# EAGLE design sbus-ppm (EAGLE 6.2)
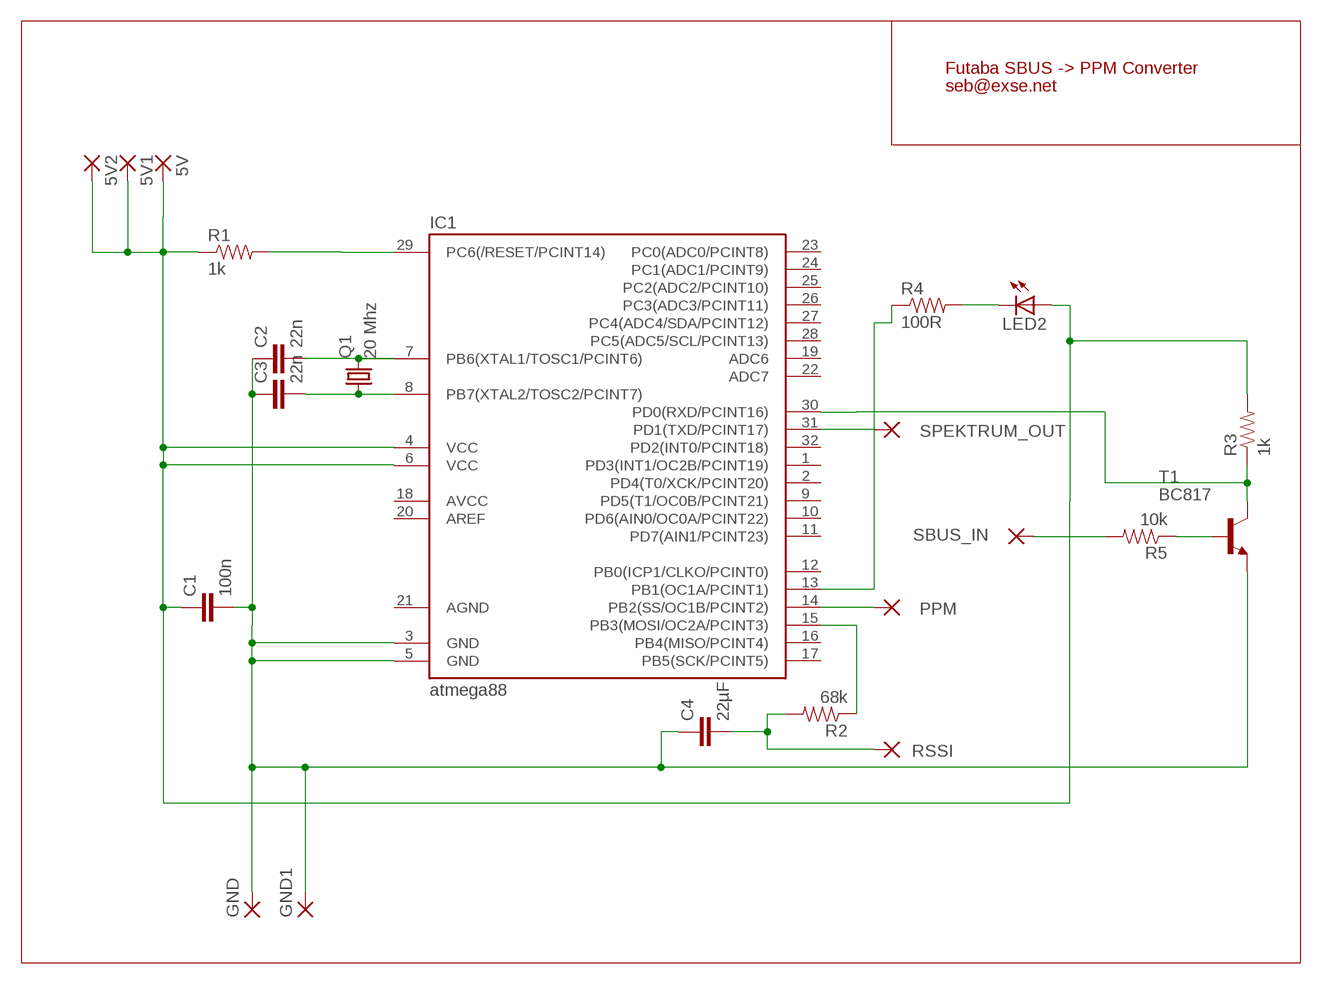
[diagram p0: schematic, sheet 1]

## Parts
5V  SMD2  [SMD1,27-2,54]
5V1  SMD2  [SMD1,27-2,54]
5V2  SMD2  [SMD1,27-2,54]
C1  100n  CAP0805  [0805]
C2  22n  CAP0805  [0805]
C3  22n  CAP0805  [0805]
C4  22µF  CAP0805  [0805]
GND  SMD2  [SMD1,27-2,54]
GND1  SMD2  [SMD1,27-2,54]
IC1  atmega88  MEGA48/88/168-AU  [TQFP32-08]
LED2  LEDCHIPLED_0805  [CHIPLED_0805]
PPM  SMD2  [SMD1,27-2,54]
Q1  20 Mhz  X22-OSCILLATOR  [X22]
R1  1k  RESISTOR  [0805]
R2  68k  RESISTOR  [0805]
R3  1k  RESISTOR  [0805]
R4  100R  RESISTOR  [0805]
R5  10k  RESISTOR  [0805]
RSSI  SMD2  [SMD1,27-2,54]
SBUS_IN  SMD2  [SMD1,27-2,54]
SPEKTRUM_OUT  SMD2  [SMD1,27-2,54]
T1  BC817  BC847  [SOT23]

## Nets
+5V: 5V1.1(P) 5V2.1(P) 5V.1(P) C1.1 IC1.4(VCC) IC1.6(VCC) LED2.A R1.1 R3.2
GND: C1.2 C2.1 C3.1 C4.1 GND1.1(P) GND.1(P) IC1.3(GND) IC1.5(GND) T1.2(E)
N$3: IC1.15(PB3(MOSI/OC2A/PCINT3)) R2.1
N$4: IC1.14(PB2(SS/OC1B/PCINT2)) PPM.1(P)
N$5: R5.2 SBUS_IN.1(P)
N$7: C4.2 R2.2 RSSI.1(P)
N$8: IC1.29(PC6(/RESET/PCINT14)) R1.2
N$9: C3.2 IC1.8(PB7(XTAL2/TOSC2/PCINT7)) Q1.1
N$10: C2.2 IC1.7(PB6(XTAL1/TOSC1/PCINT6)) Q1.3
N$11: R5.1 T1.1(B)
N$12: IC1.31(PD1(TXD/PCINT17)) SPEKTRUM_OUT.1(P)
N$14: LED2.C R4.2
N$15: IC1.13(PB1(OC1A/PCINT1)) R4.1
N$16: IC1.30(PD0(RXD/PCINT16)) R3.1 T1.3(C)
Unconnected: IC1.1(PD3(INT1/OC2B/PCINT19)) IC1.2(PD4(T0/XCK/PCINT20)) IC1.9(PD5(T1/OC0B/PCINT21)) IC1.10(PD6(AIN0/OC0A/PCINT22)) IC1.11(PD7(AIN1/PCINT23)) IC1.12(PB0(ICP1/CLKO/PCINT0)) IC1.16(PB4(MISO/PCINT4)) IC1.17(PB5(SCK/PCINT5)) IC1.18(AVCC) IC1.19(ADC6) IC1.20(AREF) IC1.22(ADC7) IC1.23(PC0(ADC0/PCINT8)) IC1.24(PC1(ADC1/PCINT9)) IC1.25(PC2(ADC2/PCINT10)) IC1.26(PC3(ADC3/PCINT11)) IC1.27(PC4(ADC4/SDA/PCINT12)) IC1.28(PC5(ADC5/SCL/PCINT13)) IC1.32(PD2(INT0/PCINT18))

## Notes on the sheet
- Futaba SBUS -> PPM Converter
- seb@exse.net

## Power pins joined to a net without a drawn wire
AGND: IC1.21(AGND)

## Library data of the parts
5V 5V1 5V2 GND GND1 PPM RSSI SBUS_IN SPEKTRUM_OUT = wirepad:SMD2: SMD PAD
C1-C4 = SparkFun:CAP: Capacitor Standard 0603 ceramic capacitor, and 0.1" leaded capacitor.
IC1 = avr-4:MEGA48/88/168
LED2 = led:LED: LED OSRAM: - CHIPLED LG R971, LG N971, LY N971, LG Q971, LY Q971, LO R971, LY R971 LH N974, LH R974 LS Q976, LO Q976, LY Q976 LO Q996 - Hyper CHIPLED LW Q18S LB Q993, LB Q99A, LB R99A - SideLED LS A670, LO A670, LY A670, LG A670, LP A670 LB A673, LV A673, LT A673, LW A673 LH A674 LY A675 LS A676, LA A676, LO A676, LY A676, LW A676 LS A679, LY A679, LG A679 - Hyper Micro SIDELED® LS Y876, LA Y876, LO Y876, LY Y876 LT Y87S - SmartLED LW L88C, LW L88S LB L89C, LB L89S, LG L890 LS L89K, LO L89K, LY L89K LS L896, LA L896, LO L896, LY L896 - TOPLED LS T670, LO T670, LY T670, LG T670, LP T670 LSG T670, LSP T670, LSY T670, LOP T670, LYG T670 LG T671, LOG T671, LSG T671 LB T673, LV T673, LT T673, LW T673 LH T674 LS T676, LA T676, LO T676, LY T676, LB T676, LH T676, LSB T676, LW T676 LB T67C, LV T67C, LT T67C, LS T67K, LO T67K, LY T67K, LW E67C LS E67B, LA E67B, LO E67B, LY E67B, LB E67C, LV E67C, LT E67C LW T67C LS T679, LY T679, LG T679 LS T770, LO T770, LY T770, LG T770, LP T770 LB T773, LV T773, LT T773, LW T773 LH T774 LS E675, LA E675, LY E675, LS T675 LS T776, LA T776, LO T776, LY T776, LB T776 LHGB T686 LT T68C, LB T68C - Hyper Mini TOPLED® LB M676 - Mini TOPLED Santana® LG M470 LS M47K, LO M47K, LY M47K Source: http://www.osram.convergy.de LUXEON: - LUMILED® LXK2-PW12-R00, LXK2-PW12-S00, LXK2-PW14-U00, LXK2-PW14-V00 LXK2-PM12-R00, LXK2-PM12-S00, LXK2-PM14-U00 LXK2-PE12-Q00, LXK2-PE12-R00, LXK2-PE12-S00, LXK2-PE14-T00, LXK2-PE14-U00 LXK2-PB12-K00, LXK2-PB12-L00, LXK2-PB12-M00, LXK2-PB14-N00, LXK2-PB14-P00, LXK2-PB14-Q00 LXK2-PR12-L00, LXK2-PR12-M00, LXK2-PR14-Q00, LXK2-PR14-R00 LXK2-PD12-Q00, LXK2-PD12-R00, LXK2-PD12-S00 LXK2-PH12-R00, LXK2-PH12-S00 LXK2-PL12-P00, LXK2-PL12-Q00, LXK2-PL12-R00 Source: www.luxeon.com KINGBRIGHT: KA-3528ASYC Source: www.kingbright.com
Q1 = seb:X22-OSCILLATOR
R1-R5 = SparkFun:RESISTOR: Resistor Basic schematic elements and footprints for 0603, 1206, and PTH 1/10th watt (small) resistors.
T1 = transistor:BC847: NPN TRANSISTOR

## Board
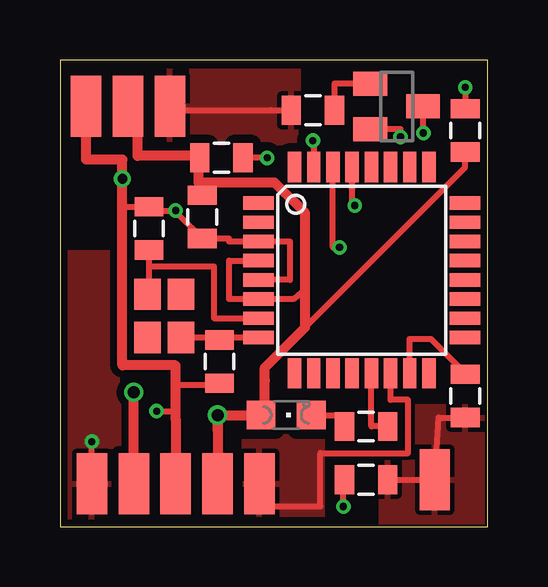
[diagram p1: board, top side]
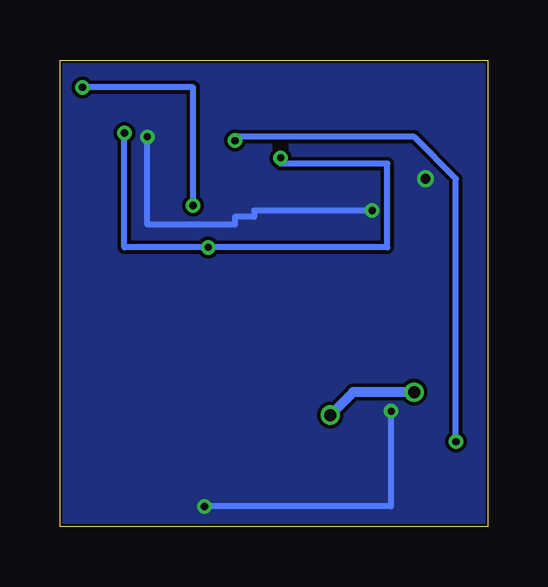
[diagram p2: board, bottom side, seen from below]

Size 17.82 x 19.45 mm. Coordinates in mm from the lower left corner, seen from the top.
Outline: 0,0 17.82,0 17.82,19.45 0,19.45 0,0
Copper layers (1*16): Top 0.035mm / dielectric 1.5mm / Bottom 0.035mm
Design rules "default": minimum track width 0.15mm, minimum drill 0.3mm, track to track 0.15mm, track to pad 0.15mm, pad to pad 0.15mm, via to via 0.15mm, smd to smd 0.15mm, copper to edge 0.1mm, drill to drill 0.2mm, minimum pad ring 0.2mm, minimum via ring 0.15mm, stop-mask expansion 0.075mm, vias tented up to drill 30mil, thermal gap 0.2mm

### Footprints (pad centres in the part's own frame; a part is rotated, then mirrored left to right if it is on the bottom)
SMD1,27-2,54 = smd 1.27 x 2.54: 1 0,0
0805 = smd 0.8 x 1.2: 1 -0.9,0; 2 0.9,0
TQFP32-08 = smd 1.27 x 0.559: 1 -4.293,2.8; 2 -4.293,2; 3 -4.293,1.2; 4 -4.293,0.4; 5 -4.293,-0.4; 6 -4.293,-1.2; 7 -4.293,-2; 8 -4.293,-2.8; 17 4.293,-2.8; 18 4.293,-2; 19 4.293,-1.2; 20 4.293,-0.4; 21 4.293,0.4; 22 4.293,1.2; 23 4.293,2; 24 4.293,2.8 | smd 0.559 x 1.27: 9 -2.8,-4.293; 10 -2,-4.293; 11 -1.2,-4.293; 12 -0.4,-4.293; 13 0.4,-4.293; 14 1.2,-4.293; 15 2,-4.293; 16 2.8,-4.293; 25 2.8,4.293; 26 2,4.293; 27 1.2,4.293; 28 0.4,4.293; 29 -0.4,4.293; 30 -1.2,4.293; 31 -2,4.293; 32 -2.8,4.293
CHIPLED_0805 = smd 1.2 x 1.2: A 0,-1.05; C 0,1.05
X22 = smd 1.3 x 1.1: 1 0.9,0.7; 2 -0.9,0.7; 3 -0.9,-0.7; 4 0.9,-0.7
SOT23 = smd 1 x 1.4: 1 -0.95,-1.1; 2 0.95,-1.1; 3 0,1.1

### Placement (x,y rotation side)
5V  2.84,17.52 0 top
5V1  6.57,1.8 180 top
5V2  3.07,1.8 0 top
C1  5.93,12.92 270 top
C2  3.71,12.44 270 top
C3  6.64,6.88 90 top
C4  12.76,1.96 0 top
GND  1.09,17.52 180 top
GND1  4.82,1.8 180 top
IC1  12.57,10.69 0 top
LED2  9.42,4.66 270 top
PPM  8.31,1.8 180 top
Q1  4.34,8.79 270 top
R1  16.88,16.52 90 top
R2  16.88,5.45 270 top
R3  6.72,15.38 180 top
R4  12.76,4.18 180 top
R5  10.53,17.36 180 top
RSSI  15.61,1.96 0 top
SBUS_IN  4.58,17.52 180 top
SPEKTRUM_OUT  1.33,1.8 0 top
T1  14.03,17.52 270 top

### Tracks (layer width: path | path; a pad name or v marks a point on that pad's centre or on a via)
+5V  (via drill 0.5)
  Top 0.254: 10.21,8.32 16.88,14.99 R1.1 | 10.21,9.9 9.74,9.49 IC1.6 7.04,9.49 7.04,11.09 IC1.4 | 5.77,15.46 R3.2 | LED2.A 8.85,4.66 8.53,4.66 | C1.1 6.46,14.34 5.77,14.34
  Top 0.406: v6.57,4.66 5V1.1 | 5V2.1 v3.07,5.61 | v6.57,4.66 8.53,4.66 8.53,6.09 8.53,6.64 10.21,8.32 10.21,9.9 10.21,13.08 8.95,14.34 5.77,14.34 5.77,15.46 3.23,15.46 3.23,17.52 5V.1 | v6.57,4.66 6.57,4.03 v6.57,4.66
  Bottom 0.406: v6.57,4.66 5.61,5.61 v3.07,5.61
GND  (via drill 0.3, 0.4)
  Top 0.254: 2.6,13.34 C2.1 3.39,13.18 v4.82,13.18 4.98,12.97 C1.2 7.04,12.02 7.04,11.89 IC1.3 9.58,11.89 9.58,10.29 IC1.5 | 4.82,2.91 GND1.1 | C4.1 11.8,1.96 v11.8,0.85 | v4.03,4.82 4.82,4.82 4.82,4.5 | T1.2 14.19,16.57 v14.19,16.25 | C3.1 6.54,5.93 4.82,5.93
  Top 0.406: 4.82,2.91 4.82,4.5 4.82,5.93 4.82,6.72 2.6,6.72 2.6,13.34 v2.6,14.5 2.6,15.3 1.09,15.3 GND.1
  Bottom 0.254: v11.8,0.85 4.03,0.85 v4.03,4.82 | v14.19,16.25 14.19,12.6 10.53,12.6 10.53,12.92 9.74,12.92 9.74,13.18 v4.82,13.18
  pour Bottom: 0.06,19.27 17.84,19.27 17.84,0.06 0.06,0.06
N$3
  Top 0.254: R2.1 16.88,6.41 15.46,7.84 14.57,7.84 IC1.15
N$4
  Top 0.254: PPM.1 8.15,1.8 8.15,0.85 10.85,0.85 10.85,3.07 14.5,3.07 14.5,5.3 13.77,5.3 IC1.14
  pour Top (isolate 0.406): 7.68,-0.02 10.93,-0.02 10.93,3.95 7.68,3.95
N$5
  Top 0.254: 8.79,17.36 R5.2 | 8.79,17.36 | 8.79,17.36 4.98,17.36 SBUS_IN.1
  pour Top (isolate 0.356): 4.34,19.35 9.9,19.35 9.9,16.01 4.34,16.01
N$7
  Top 0.254: 13.55,2.17 C4.2 14.61,1.96 RSSI.1 15.77,4.55 R2.2
  pour Top: 13.39,0.06 17.84,0.06 17.84,4.98 13.39,4.98
N$8  (via drill 0.3)
  Top 0.254: v16.88,18.31 R1.2 | v12.28,13.39 12.17,13.39 IC1.29
  Bottom 0.254: v12.28,13.39 12.28,18.31 v16.88,18.31
N$9
  Top 0.254: 6.64,7.89 C3.2 | 6.64,7.89 IC1.8 | Q1.1 5.2,7.89 6.64,7.89
N$10
  Top 0.254: Q1.3 3.71,9.21 3.71,10.85 | IC1.7 6.41,8.69 6.41,10.85 3.71,10.85 | 3.71,10.85 C2.2
N$11
  Top 0.254: T1.1 11.43,18.47 R5.1
N$12  (via drill 0.3)
  Top 0.254: IC1.31 10.57,16.09 v10.53,16.09 | SPEKTRUM_OUT.1 v1.33,3.55 | SPEKTRUM_OUT.1
  Bottom 0.254: v10.53,16.09 10.53,16.25 3.07,16.25 1.33,14.5 v1.33,3.55
  pour Top (isolate 0.305): 0.06,0.06 2.44,0.06 2.44,11.41 0.06,11.41
N$14
  Top 0.254: LED2.C 11.86,4.66 R4.2
N$15
  Top 0.254: R4.1 12.97,4.18 IC1.13
N$16  (via drill 0.3)
  Top 0.254: T1.3 v15.14,16.41 | v11.65,11.65 11.37,11.65 IC1.30 | v8.63,15.38 R3.1
  Bottom 0.254: v15.14,16.41 15.14,11.65 v11.65,11.65 4.18,11.65 4.18,15.14 8.63,15.14 v8.63,15.38

### Text on the board
tStop: SBUS | Spektrum | PPM | RSSI
bStop: SBUS TO PPM | seb@exse.net